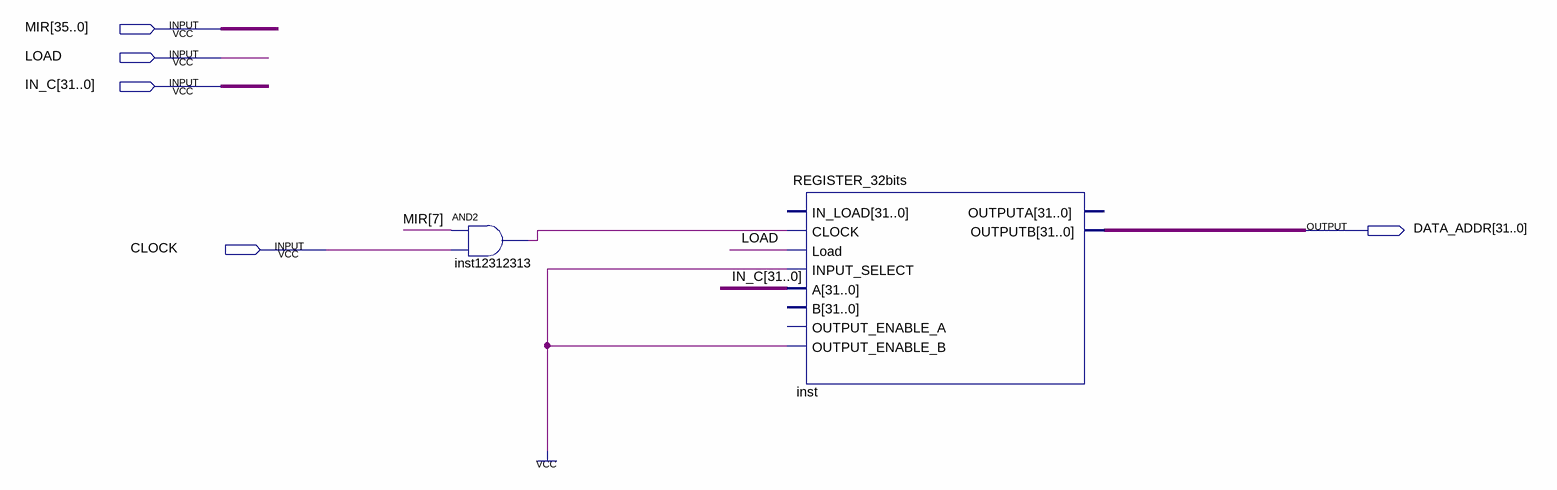
[diagram p0: schematic sheet]
// Quartus schematic MAR.bdf as structural Verilog: 2 symbols, 5 pins
module MAR (
  input  [35:0] MIR,
  input  LOAD,
  input  [31:0] IN_C,
  input  CLOCK,
  output [31:0] DATA_ADDR
);

  wire inst12312313_out;

  and inst12312313 (inst12312313_out, MIR[7], CLOCK);
  REGISTER_32bits inst (
    .CLOCK(inst12312313_out), .Load(LOAD), .INPUT_SELECT(1'b1), .A(IN_C), .OUTPUT_ENABLE_B(1'b1),
    .OUTPUTB(DATA_ADDR));  // open: IN_LOAD, B, OUTPUT_ENABLE_A, OUTPUTA
endmodule
